# Altium schematic sheet charger_schematic.SchDoc
size A4; SheetNumber: 1; SheetTotal: 1
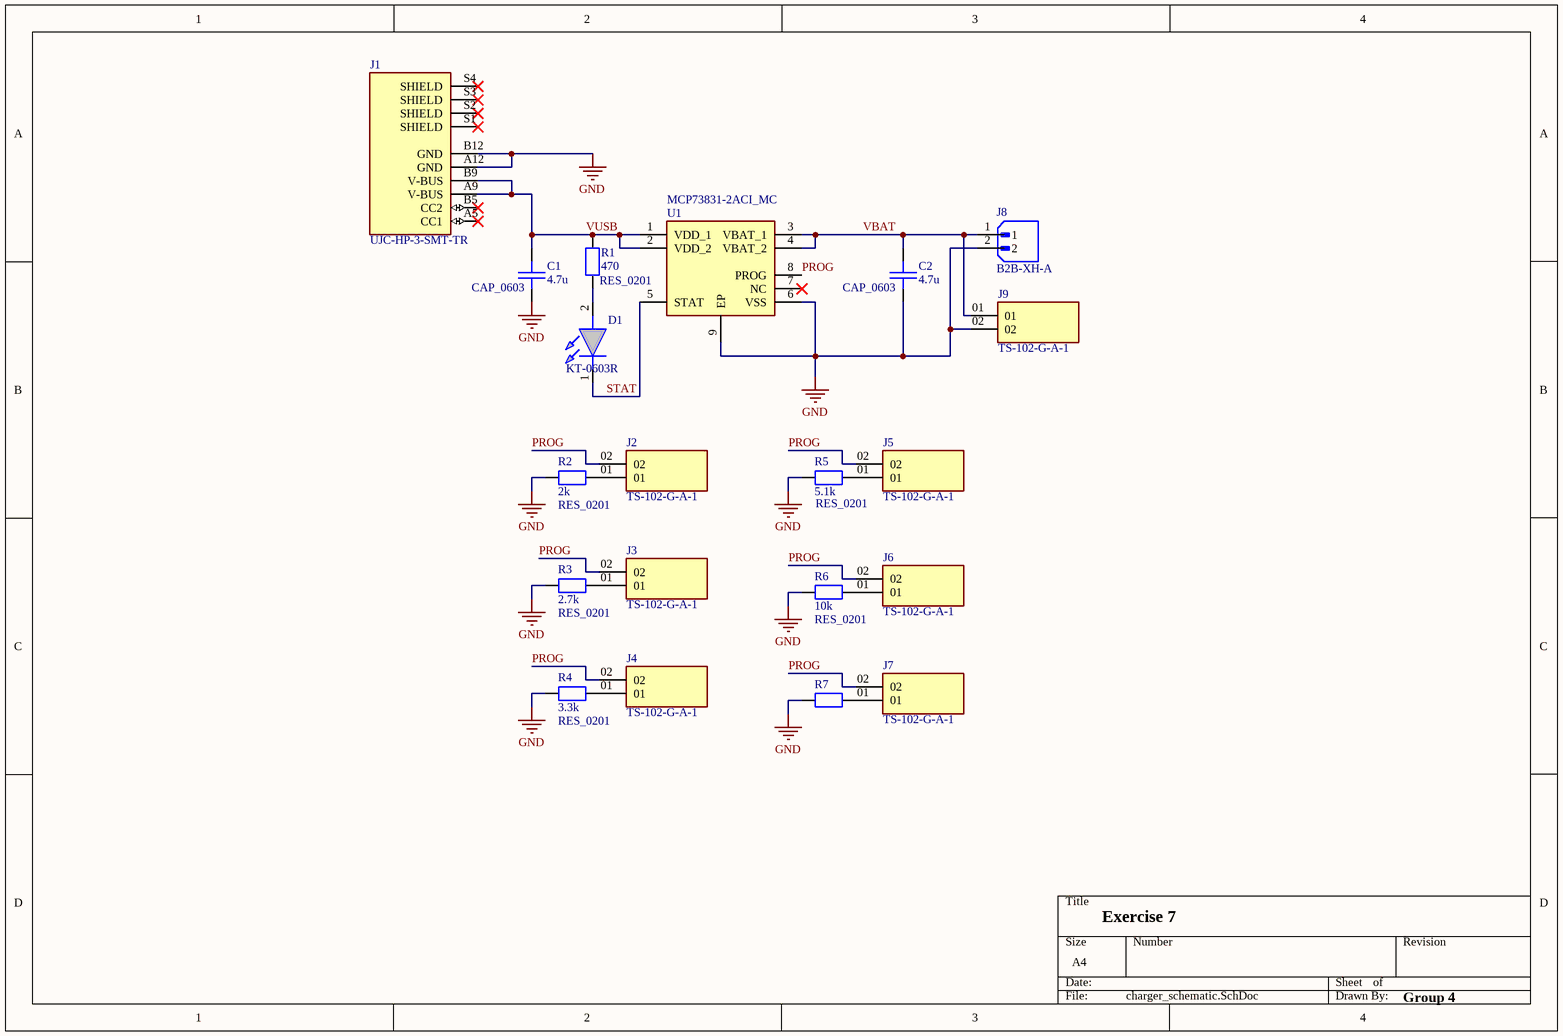
[diagram p0: charger_schematic.SchDoc]

## Parts
C1  CAP_0603  value 4.7u  [CAP_0603]
C2  CAP_0603  value 4.7u  [CAP_0603]
D1  KT-0603R  [LEDC1608X70N]
J1  UJC-HP-3-SMT-TR  [CUI_UJC-HP-3-SMT-TR]
J2  TS-102-G-A-1  [SAMTEC_TS-102-G-A-1]
J3  TS-102-G-A-1  [SAMTEC_TS-102-G-A-1]
J4  TS-102-G-A-1  [SAMTEC_TS-102-G-A-1]
J5  TS-102-G-A-1  [SAMTEC_TS-102-G-A-1]
J6  TS-102-G-A-1  [SAMTEC_TS-102-G-A-1]
J7  TS-102-G-A-1  [SAMTEC_TS-102-G-A-1]
J8  B2B-XH-A  [JST_B2B-XH-A]
J9  TS-102-G-A-1  [SAMTEC_TS-102-G-A-1]
R1  RES_0201  value 470  [RES_0201]
R2  RES_0201  value 2k  [RES_0201]
R3  RES_0201  value 2.7k  [RES_0201]
R4  RES_0201  value 3.3k  [RES_0201]
R5  RES_0201  value 5.1k  [RES_0201]
R6  RES_0201  value 10k  [RES_0201]
R7  (no value)  [PCBComponent_1]
U1  MCP73831-2ACI_MC  [SON50P300X200X100-9N-D]

## Nets
GND: C1.1 C2.1 J1.A12(GND) J1.B12(GND) J8.2 J9.02 R2.2 R3.2 R4.2 R5.2 R6.2 R7.2 U1.6(VSS) U1.9(EP)
PROG: J2.02 J3.02 J4.02 J5.02 J6.02 J7.02 U1.8(PROG)
STAT: D1.1(K) U1.5(STAT)
VBAT: C2.2 J8.1 J9.01 U1.3(VBAT_1) U1.4(VBAT_2)
VUSB: C1.2 J1.A9(V-BUS) J1.B9(V-BUS) R1.2 U1.1(VDD_1) U1.2(VDD_2)
NetD1_2: D1.2(A) R1.1
NetJ2_01: J2.01 R2.1
NetJ3_01: J3.01 R3.1
NetJ4_01: J4.01 R4.1
NetJ5_01: J5.01 R5.1
NetJ6_01: J6.01 R6.1
NetJ7_01: J7.01 R7.1

Not connected (* = marked no-connect by the designer): J1 A5(CC1)* B5(CC2)* S1(SHIELD)* S2(SHIELD)* S3(SHIELD)* S4(SHIELD)*; U1 7(NC)*

## Notes on the sheet
- Exercise 7
- Group 4

## Library data of the parts
D1 = KT-0603R: Red 615~630nm 1.9~2.2V 0603 Light Emitting Diodes (LED) RoHS; Manufacturer_Name: Hubei KENTO Elec; Geometry.Height: 0.7mm; Manufacturer_Part_Number: KT-0603R; Mouser Part Number: *; Mouser Price/Stock: *; Arrow Part Number: *; Arrow Price/Stock: *; Datasheet Link: https://datasheet.lcsc.com/szlcsc/Hubei-KENTO-Elec-KT-0603R_C2286.pdf
J2-J7 J9 = TS-102-G-A-1: MF: {'manufacturer': u'Samtec Inc.'}; MP: TS-102-G-A-1; Availability: Unavailable; Value: *; Price: None; Package: None
J8 = B2B-XH-A: MF: {'manufacturer': u'JST Sales America Inc.'}; Package: None; Price: None; Value: *; MP: B2B-XH-A; Availability: Unavailable
R7 = R_THT
U1 = MCP73831-2ACI_MC: Microchip MCP73831-2ACI/MC, Battery Charge Controller Lithium-Ion, Lithium-Polymer, 8-pin DFN; Geometry.Height: 1mm; Manufacturer_Name: Microchip; Manufacturer_Part_Number: MCP73831-2ACI/MC; Mouser Part Number: 579-MCP73831-2ACI/MC; Mouser Price/Stock: https://www.mouser.co.uk/ProductDetail/Microchip-Technology/MCP73831-2ACI-MC?qs=hH%252BOa0VZEiBneYTVdpuVdg%3D%3D; Arrow Part Number: MCP73831-2ACI/MC; Arrow Price/Stock: https://www.arrow.com/en/products/mcp73831-2acimc/microchip-technology?region=nac; Datasheet Link: https://datasheet.datasheetarchive.com/originals/distributors/SFDatasheet-4/sf-00090108.pdf
C1 C2 = CAP_0603: LCSC: *; Tolerance: *; Voltage Rating: *; Capacitor Type: *
J1 = UJC-HP-3-SMT-TR: Package: None; Price: None; Value: *; MP: UJC-HP-3-SMT-TR; Availability: Unavailable
R1-R6 = RES_0201: LCSC: *; Tolerance: *; Voltage Rating: *